# EAGLE design termistor (EAGLE 7.2.0)
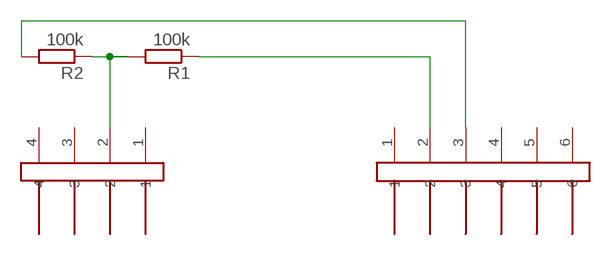
[diagram p0: schematic, sheet 1]

## Parts
R1  100k  R-EU_R0603  [R0603]
R2  100k  R-EU_R0603  [R0603]
U$8  JUMPER6M  [JUMPER6M]
U$9  JUMPER4M  [JUMPER4M]

## Nets
N$1: R1.2 R2.1 U$9.2
N$2: R1.1 U$8.2
N$3: R2.2 U$8.3
Unconnected: U$8.1 U$8.4 U$8.5 U$8.6 U$9.1 U$9.3 U$9.4

## Library data of the parts
R1 R2 = resistor:R-EU_: RESISTOR, European symbol
U$8 = !stavebnice03:JUMPER6M
U$9 = !stavebnice03:JUMPER4M

## Net classes
0 default: clearance 0.205 mm

## Board
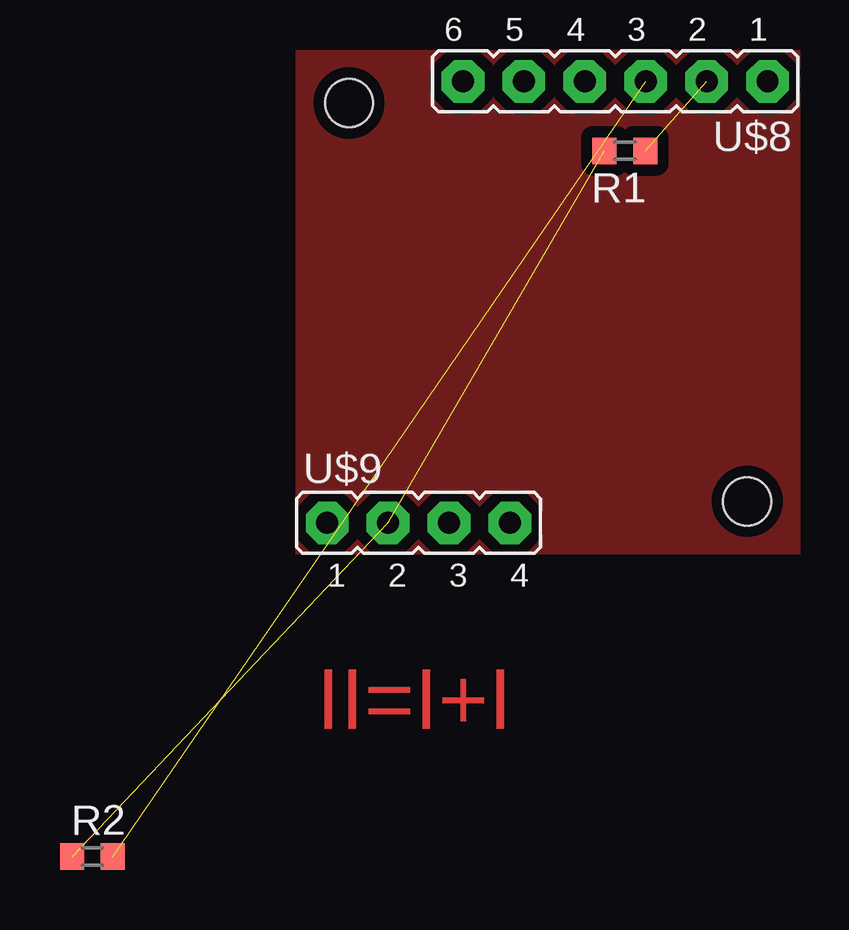
[diagram p1: board, top side]
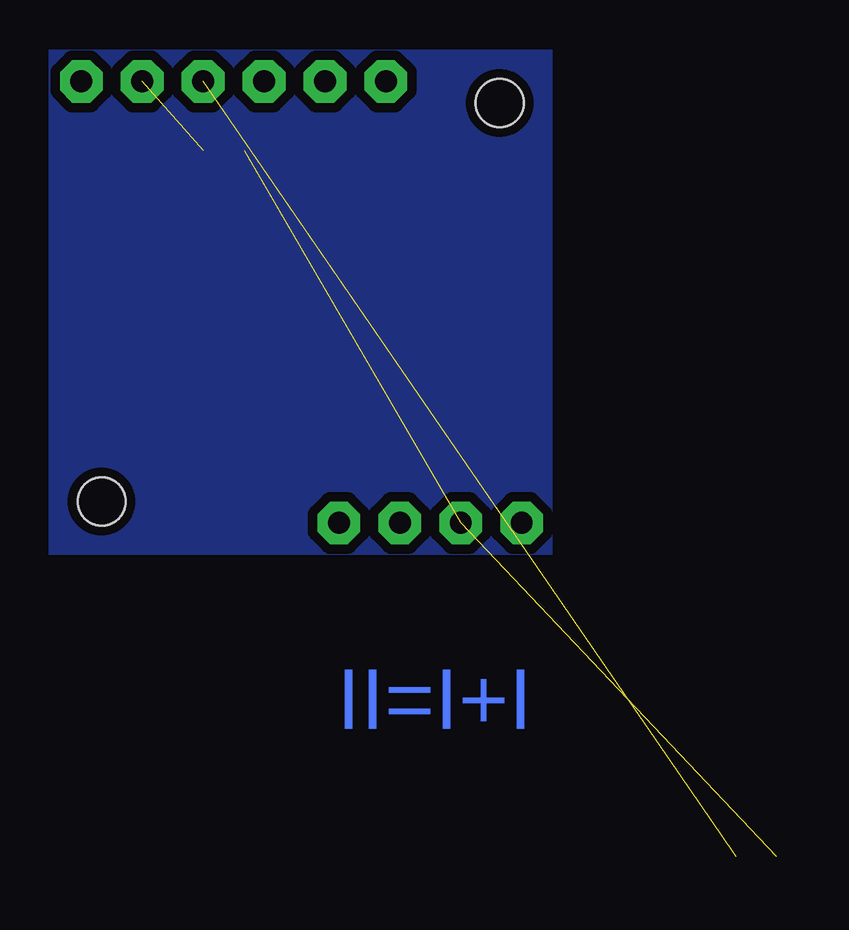
[diagram p2: board, bottom side, seen from below]

No outline drawn. Coordinates in mm, seen from the top.
Copper layers (1*16): Top 0.035mm / dielectric 1.5mm / Bottom 0.035mm
Design rules "default *": minimum track width 10mil, minimum drill 24mil, track to track 8mil, track to pad 8mil, pad to pad 8mil, via to via 8mil, smd to smd 8mil, copper to edge 0mil, drill to drill 1mil, minimum pad ring 10mil, minimum via ring 8mil, stop-mask expansion 4mil, vias tented up to drill 0mil, thermal gap 10mil
Holes 2 mm at 2.2,18.8 18.8,2.2

### Footprints (pad centres in the part's own frame; a part is rotated, then mirrored left to right if it is on the bottom)
R0603 = smd 1 x 1.1: 1 -0.85,0; 2 0.85,0
JUMPER6M = drill 0.914 pad 1.778 octagon: 1 -6.35,0; 2 -3.81,0; 3 -1.27,0; 4 1.27,0; 5 3.81,0; 6 6.35,0
JUMPER4M = drill 0.914 pad 1.778 octagon: 1 -3.81,0; 2 -1.27,0; 3 1.27,0; 4 3.81,0

### Placement (x,y rotation side)
R1  13.7,16.8 180 top
R2  -8.5,-12.6 0 top
U$8  13.3,19.7 180 top
U$9  5.1,1.3 0 top

### Tracks (layer width: path | path; a pad name or v marks a point on that pad's centre or on a via)
GND
  pour Top (isolate 0.483, rank 2, no thermals): 0,0 0,21 21,21 21,0
  pour Bottom (isolate 0.406, rank 2, no thermals): 0,0 0,21 21,21 21,0
N$1  (2 unrouted)
N$2  (1 unrouted)
N$3  (1 unrouted)

### Text on the board
Top: II=I+I
Bottom: II=I+I
Dimension: rgb extension